# EAGLE design UVandLight(I2C_V3) (EAGLE 6.5.0)
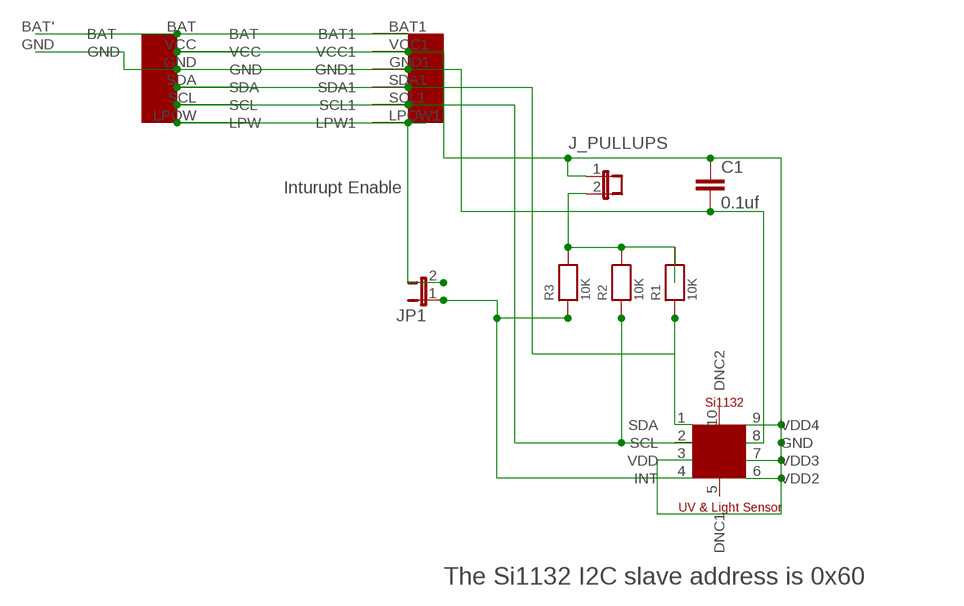
[diagram p0: schematic, sheet 1]

## Parts
C1  0.1uf  CAP0402-CAP  [0402-CAP]
J_PULLUPS  JUMPER-2PAD  [JUMPER-2PAD]
JP1  JUMPER-2SMD-NO-NS  [SJ_2S-NO-NS]
R1  10K  RESISTOR0402  [0402]
R2  10K  RESISTOR0402  [0402]
R3  10K  RESISTOR0402  [0402]
U$1  EZ-I2CHEADERV1  [EZ-I2CHEADERV1]
U$2  UV-SI1132  [UV-SI1132]
U$4  MINI_BATTERY_HOLES  [MINI_BATTERY_HOLES]

## Nets
GND: C1.2 U$1.GND U$1.GND1 U$2.8(GND) U$4.GND
N$2: R1.1 U$1.SDA U$1.SDA1 U$2.1(SDA)
N$3: JP1.1 R3.1 U$2.4(INT)
N$4: U$1.BAT U$1.BAT1 U$4.BAT'(BAT)
N$5: JP1.2 U$1.LPOW1(LPW1) U$1.LPOW(LPW)
N$7: J_PULLUPS.2 R1.2 R2.2 R3.2
N$13: C1.1 J_PULLUPS.1 U$1.VCC U$1.VCC1 U$2.3(VDD) U$2.6(VDD2) U$2.7(VDD3) U$2.9(VDD4)
N$17: R2.1 U$1.SCL U$1.SCL1 U$2.2(SCL)
Unconnected: U$2.5(DNC1) U$2.10(DNC2)

## Notes on the sheet
- Inturupt Enable
- The Si1132 I2C slave address is 0x60

## Library data of the parts
C1 = SparkFun-Capacitors:CAP: Capacitor Standard 0603 ceramic capacitor, and 0.1" leaded capacitor.
J_PULLUPS = UniqueInteractionsLib:JUMPER-2PAD
JP1 = SparkFun-Passives:JUMPER-2: Jumper Basic 0.1" spaced jumper. Use with breakaway headers.
R1-R3 = microbuilder:RESISTOR: Resistors 0402 - 0402 Surface Mount Package 22 Ohm 1% 1/16W [Digikey: 311-22.0LRTR-ND] 33 Ohm 5% 1/16W 1.0K 5% 1/16W 1.5K 5% 1/16W 2.0K 1% 1/16W 10.0K 1% 1/16W [Digikey: 311-10.0KLRTR-ND] 10.0K 5% 1/16W [Digikey: RMCF0402JT10K0TR-ND] 12.1K 1% 1/16W [Digikey: 311-22.0LRTR-ND] 100.0K 5% 1/16W 0603 - 0603 Surface Mount Package 0 Ohm 1/10 Watt 1% Resistor 15 Ohm 1/10 Watt 1% Resistor 33 Ohm 1/10 Watt 1% Resistor 49.9 Ohm 1/10 Watt 1% Resistor 100 Ohm 1/10 Watt 1% Resistor 150 Ohm 1/10 Watt 1% Resistor 240 Ohm 1/10 Watt 1% Resistor 390 Ohm 1/10 Watt 1% Resistor 560 Ohm 1/10 Watt 1% Resistor 680 Ohm 1/10 Watt 1% Resistor 750 Ohm 1/10 Watt 1% Resistor 1.0K Ohm 1/10 Watt 1% Resistor 1.5K Ohm 1/10 Watt 1% Resistor 2.0K Ohm 1/10 Watt 1% Resistor 2.2K Ohm 1/10 Watt 1% Resistor 3.3K Ohm 1/10 Watt 1% Resistor 4.7K Ohm 1/10 Watt 1% Resistor 10.0K Ohm 1/10 Watt 1% Resistor 12.0K Ohm 1/10 Watt 1% Resistor 12.1K Ohm 1/10 Watt 1% Resistor 20.0K Ohm 1/10 Watt 1% Resistor 33.0K Ohm 1/10 Watt 1% Resistor 100.0K Ohm 1/10 Watt 1% Resistor 0805 - 0805 Surface Mount Package 0 Ohm 1/8 Watt 1% Resistor 33 Ohm 1/8 Watt 1% Resistor 100 Ohm 1/8 Watt 1% Resistor 150 Ohm 1/8 Watt 1% Resistor 200 Ohm 1/8 Watt 1% Resistor 240 Ohm 1/8 Watt 1% Resistor 330 Ohm 1/8 Watt 1% Resistor 390 Ohm 1/8 Watt 1% Resistor 470 Ohm 1/8 Watt 1% Resistor 1.0K Ohm 1/8 Watt 1% Resistor 1.5K Ohm 1/8 Watt 1% Resistor 2.0K Ohm 1/8 Watt 1% Resistor 4.7K Ohm 1/8 Watt 1% Resistor 5.1K Ohm 1/8 Watt 1% Resistor 5.6K Ohm 1/8 Watt 1% Resistor 10.0K Ohm 1/8 Watt 1% Resistor 22.0K Ohm 1/8 Watt 1% Resistor 33.0K Ohm 1/8 Watt 1% Resistor 100K Ohm 1/8 Watt 1% Resistor 1206 - 1206 Surface Mount Package 2012 - 2010 Surface Mount Package 0.11 Ohm 1/2 Watt 1% Resistor - Digikey: RHM.11UCT-ND
U$1 = UniqueInteractionsLib:EZ-I2CHEADERV1
U$2 = UniqueInteractionsLib:UV-SI1132: UV and Light Sensor Si1132 Order from Mouser 1: £1.11 25: £1.08 100: £1.04 http://uk.mouser.com/ProductDetail/Silicon-Labs/Si1132-A10-GMR/?qs=sGAEpiMZZMsrChSOYEGTCQcGlzpp%252bxLilVzr3TdZGsg%3d
U$4 = UniqueInteractionsLib:MINI_BATTERY_HOLES

## Board
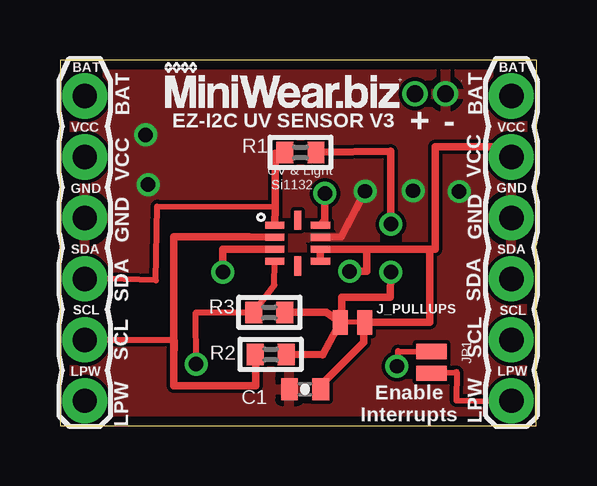
[diagram p1: board, top side]
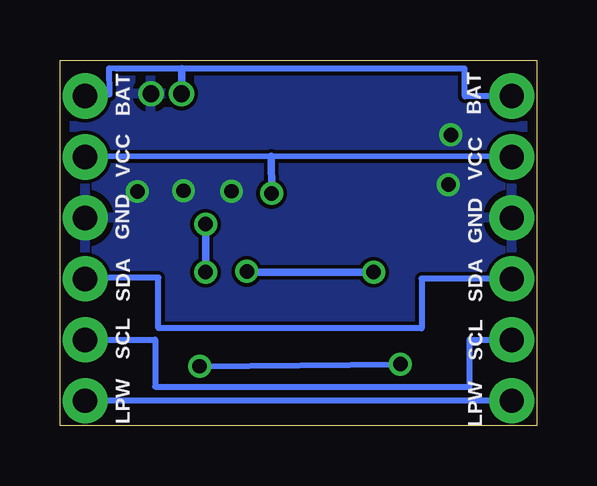
[diagram p2: board, bottom side, seen from below]

Size 19.86 x 15.23 mm. Coordinates in mm from the lower left corner, seen from the top.
Outline: 0,0 19.84,0 19.86,15.23 0,15.21 0,0
Copper layers (1*16): Top 0.0356mm / dielectric 1.5011mm / Bottom 0.0356mm
Design rules "oshParkPCBDesignRules": minimum track width 6mil, minimum drill 13mil, track to track 6mil, track to pad 6mil, pad to pad 6mil, via to via 6mil, smd to smd 6mil, copper to edge 15mil, drill to drill 6mil, minimum pad ring 7mil, minimum via ring 7mil, stop-mask expansion 3mil, vias tented up to drill 0mil, thermal gap 10mil

### Footprints (pad centres in the part's own frame; a part is rotated, then mirrored left to right if it is on the bottom)
0402-CAP = smd 0.7 x 0.9: 1 -0.65,0; 2 0.65,0
JUMPER-2PAD = smd 0.635 x 1.016: 1 -0.508,0; 2 0.508,0
SJ_2S-NO-NS = smd 0.635 x 1.27: 1 -0.45,0; 2 0.45,0
0402 = smd 0.7 x 0.9: 1 -0.65,0; 2 0.65,0
EZ-I2CHEADERV1 = drill 1.016 pad 1.88: BAT 0,-1.27; BAT1 17.78,-1.27; GND 0,-6.35; GND1 17.78,-6.35; LPOW 0,-13.97; LPOW1 17.78,-13.97; SCL 0,-11.43; SCL1 17.78,-11.43; SDA 0,-8.89; SDA1 17.78,-8.89; VCC 0,-3.81; VCC1 17.78,-3.81
UV-SI1132 = smd 0.8 x 0.3: 1 -0.95,1.7; 2 -0.95,1.2; 3 -0.95,0.7; 4 -0.95,0.2; 6 0.95,0.2; 7 0.95,0.7; 8 0.95,1.2; 9 0.95,1.7 | smd 0.3 x 0.8: 5 0,0; 10 0,1.9
MINI_BATTERY_HOLES = drill 0.7 pad 1.016: BAT' 0.435,3.175; GND 0.435,1.905

### Placement (x,y rotation side)
C1  10.21,1.51 180 top
J_PULLUPS  12.19,4.3 180 top
JP1  15.47,2.63 270 top
R1  10.02,11.38 0 top
R2  8.78,2.96 0 top
R3  8.72,4.71 0 top
U$1  1.03,15 0 top
U$2  9.9,6.65 0 top
U$3  [LOGO2]  4.26,13.06 0 top
U$4  17.97,13.39 90 top

### Tracks (layer width: path | path; a pad name or v marks a point on that pad's centre or on a via)
GND  (via drill 0.6)
  Top 0.305: U$2.8 11.72,7.86 v12.71,9.76
  other vias: 3.67,10.04 14.71,9.78 3.57,12.11 16.63,9.75
  pour Bottom: -0.13,15.57 19.92,15.57 19.84,0.12 -0.21,0.12
  pour Top: -0.09,0.03 0.07,15.14 19.96,15.14 19.8,0.03
N$2
  Top 0.254: 8.96,9.11 4.05,9.13 3.99,6.05 1.26,6.14 U$1.SDA
  Top 0.305: R1.1 8.97,11.35 8.96,9.11 U$2.1
  Bottom 0.254: U$1.SDA 4.79,6.12 4.79,4.05 15.76,4.06 15.76,6.16 17.8,6.16 U$1.SDA1
N$3  (via drill 0.6)
  Top 0.254: U$2.4 8.93,5.85 R3.1 5.66,4.71 v5.67,2.56 | v14.04,2.47 14.08,3.1 JP1.1
  Bottom 0.254: v14.04,2.47 v5.67,2.56
N$4
  Bottom 0.254: U$1.BAT 2.99,13.71 3,14.87 14.79,14.87 17.53,14.87 17.82,14.88 17.8,13.79 U$1.BAT1
  Bottom 0.305: U$4.BAT' 14.79,14.87
N$5
  Top 0.254: JP1.2 16.53,2.23 16.52,1.05 18.81,0.99 U$1.LPOW1
  Bottom 0.254: U$1.LPOW U$1.LPOW1
N$7  (via drill 0.6)
  Top 0.305: R2.2 10.94,2.94 J_PULLUPS.2 | R3.2 11.09,4.71 J_PULLUPS.2 | R1.2 13.79,11.43 v13.79,8.39 | v13.79,6.39 13.75,5.35 11.73,5.35 11.73,4.92 J_PULLUPS.2
  Bottom 0.305: v13.79,8.39 v13.79,6.39
N$13  (via drill 0.6)
  Top 0.305: U$2.6 U$2.7 12.79,7.35 | U$1.VCC1 18.81,11.61 15.64,11.61 15.64,7.35 15.41,7.35 | 12.79,7.35 15.41,7.35 | U$2.3 6.79,7.35 v6.79,6.39 | v12.07,6.42 12.79,6.42 12.79,7.35 | 15.41,7.35 15.41,4.3 J_PULLUPS.1 12.66,4.26 12.66,3.47 10.86,1.67 C1.1 | U$2.9 11.04,8.55 v11.04,9.67
  Bottom 0.254: U$1.VCC 11.05,11.21 U$1.VCC1
  Bottom 0.305: v6.79,6.39 12.07,6.39 v12.07,6.42 | v11.04,9.67 11.05,11.21
N$17
  Top 0.254: 4.73,1.65 4.78,3.57 U$1.SCL
  Top 0.305: R2.1 8.16,2.96 8.16,1.65 4.73,1.65 4.73,7.86 7.88,7.86 U$2.2
  Bottom 0.254: U$1.SCL1 15.89,3.58 15.89,1.62 2.79,1.62 2.79,3.58 U$1.SCL

### Text on the board
tNames: EZ-I2C UV SENSOR V3 | + | - | J_PULLUPS | Enable / Interrupts